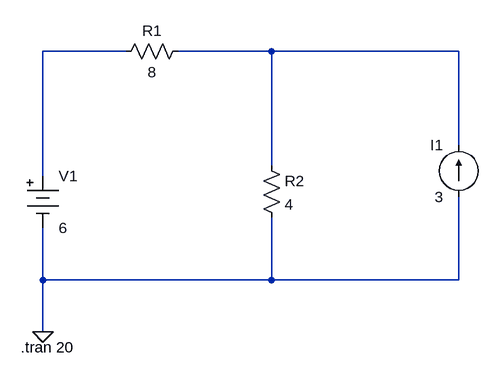
[diagram p0: schematic LAB_008_Superposition.asc]
LAB_008_Superposition.asc, the LTspice schematic file:
Version 4
SHEET 1 880 680
WIRE 272 -160 144 -160
WIRE 496 -160 352 -160
WIRE 784 -160 496 -160
WIRE 784 -16 784 -160
WIRE 496 16 496 -160
WIRE 144 32 144 -160
WIRE 144 192 144 112
WIRE 496 192 496 96
WIRE 496 192 144 192
WIRE 784 192 784 64
WIRE 784 192 496 192
WIRE 144 272 144 192
FLAG 144 272 0
SYMBOL Misc\\battery 144 16 R0
WINDOW 123 0 0 Left 0
WINDOW 39 0 0 Left 0
SYMATTR InstName V1
SYMATTR Value 6
SYMBOL res 368 -176 R90
WINDOW 0 0 56 VBottom 2
WINDOW 3 32 56 VTop 2
SYMATTR InstName R1
SYMATTR Value 8
SYMBOL res 480 0 R0
SYMATTR InstName R2
SYMATTR Value 4
SYMBOL current 784 64 R180
WINDOW 0 24 80 Left 2
WINDOW 3 24 0 Left 2
WINDOW 123 0 0 Left 0
WINDOW 39 0 0 Left 0
SYMATTR InstName I1
SYMATTR Value 3
TEXT 110 296 Left 2 !.tran 20

The netlist it stands for:
* LAB_008_Superposition.asc
V1 N001 0 6
R1 N002 N001 8
R2 N002 0 4
I1 0 N002 3
.tran 20
.backanno
.end